# EAGLE design PassivSensor-100 (EAGLE 4.15)
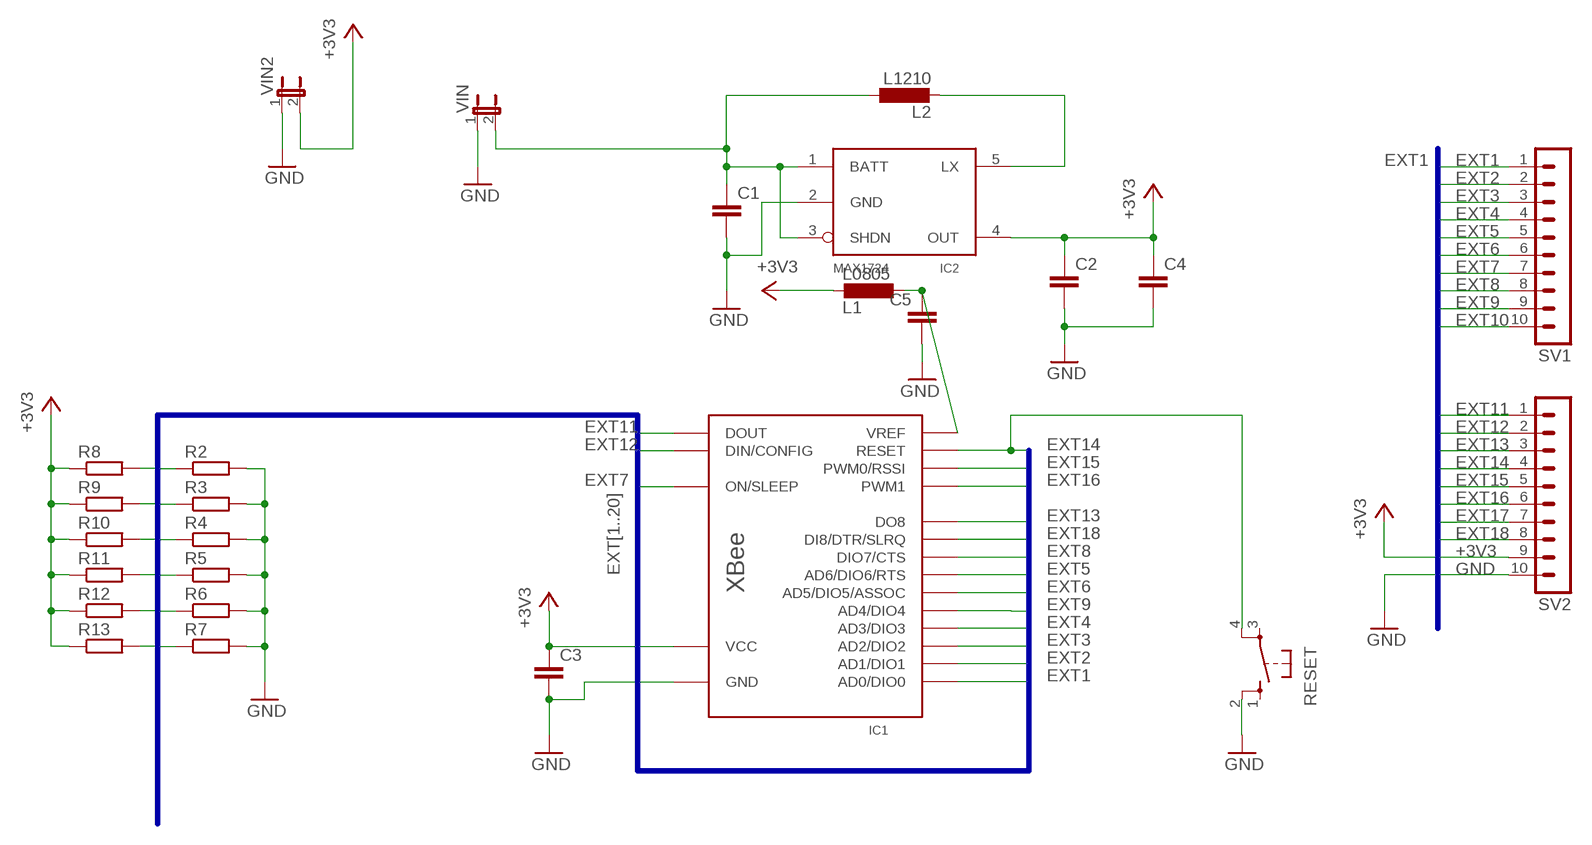
[diagram p0: schematic, sheet 1]

## Parts
C1  C-EUC0805  [C0805]
C2  C-EUC0805  [C0805]
C3  C-EUC0805  [C0805]
C4  C-EUC0805  [C0805]
C5  C-EUC0805  [C0805]
IC1  XBEE  [XBEE]
IC2  MAX1724  [SOT23-5L]
L1  L0805  [C0805]
L2  L1210  [C1210]
R2  R-EU_M0805  [M0805]
R3  R-EU_M0805  [M0805]
R4  R-EU_M0805  [M0805]
R5  R-EU_M0805  [M0805]
R6  R-EU_M0805  [M0805]
R7  R-EU_M0805  [M0805]
R8  R-EU_M0805  [M0805]
R9  R-EU_M0805  [M0805]
R10  R-EU_M0805  [M0805]
R11  R-EU_M0805  [M0805]
R12  R-EU_M0805  [M0805]
R13  R-EU_M0805  [M0805]
RESET  10XX  [B3F-10XX]
SV1  MA10-1  [MA10-1]
SV2  MA10-1  [MA10-1]
VIN  JP1E  [JP1]
VIN2  JP1E  [JP1]

## Nets
+3V3: C2.1 C3.1 C4.1 IC1.1(VCC) IC2.4(OUT) L1.2 R8.1 R9.1 R10.1 R11.1 R12.1 R13.1 SV2.9 VIN2.2
APOWER: C5.1 IC1.14(VREF) L1.1
EXT1: IC1.20(AD0/DIO0) R2.1 R8.2 SV1.1
EXT2: IC1.19(AD1/DIO1) R3.1 R9.2 SV1.2
EXT3: IC1.18(AD2/DIO2) R4.1 R10.2 SV1.3
EXT4: IC1.17(AD3/DIO3) R5.1 R11.2 SV1.4
EXT5: IC1.16(AD6/DIO6/RTS) R6.1 R12.2 SV1.5
EXT6: IC1.15(AD5/DIO5/ASSOC) R7.1 R13.2 SV1.6
EXT7: IC1.13(ON/SLEEP) SV1.7
EXT8: IC1.12(DIO7/CTS) SV1.8
EXT9: IC1.11(AD4/DIO4) SV1.9
EXT10: SV1.10
EXT11: IC1.2(DOUT) SV2.1
EXT12: IC1.3(DIN/CONFIG) SV2.2
EXT13: IC1.4(DO8) SV2.3
EXT14: IC1.5(RESET) RESET.4 SV2.4
EXT15: IC1.6(PWM0/RSSI) SV2.5
EXT16: IC1.7(PWM1) SV2.6
EXT17: SV2.7
EXT18: IC1.9(DI8/DTR/SLRQ) SV2.8
GND: C1.2 C2.2 C3.2 C4.2 C5.2 IC1.10(GND) IC2.2(GND) R2.2 R3.2 R4.2 R5.2 R6.2 R7.2 RESET.2 SV2.10 VIN2.1 VIN.1
N$1: C1.1 IC2.1(BATT) IC2.3(SHDN) L2.1 VIN.2
N$2: IC2.5(LX) L2.2
Unconnected: RESET.1 RESET.3

## Buses
EXT[1..20]

## Library data of the parts
C1-C5 = turbod3:C-EU: CAPACITOR, European symbol
IC1 = turbod3:XBEE
IC2 = turbod3:MAX1724
L1 L2 = turbod3:L
R2-R13 = turbod3:R-EU_: RESISTOR, European symbol
RESET = KEY_B:10XX
SV1 SV2 = con-lstb:MA10-1: PIN HEADER
VIN VIN2 = jumper:JP1E: JUMPER

## Net classes
0 default: width 0.406 mm

## Board
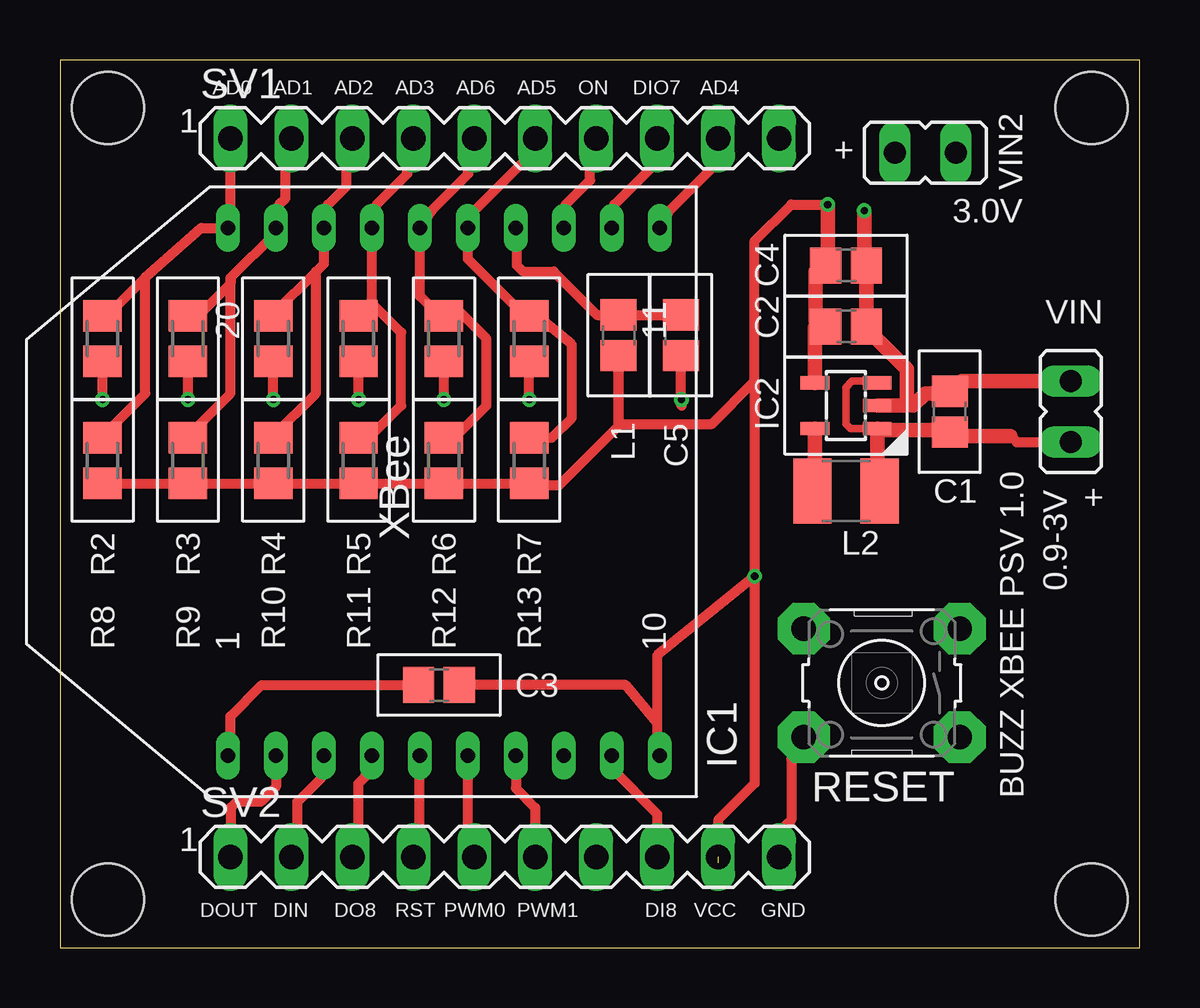
[diagram p1: board, top side]
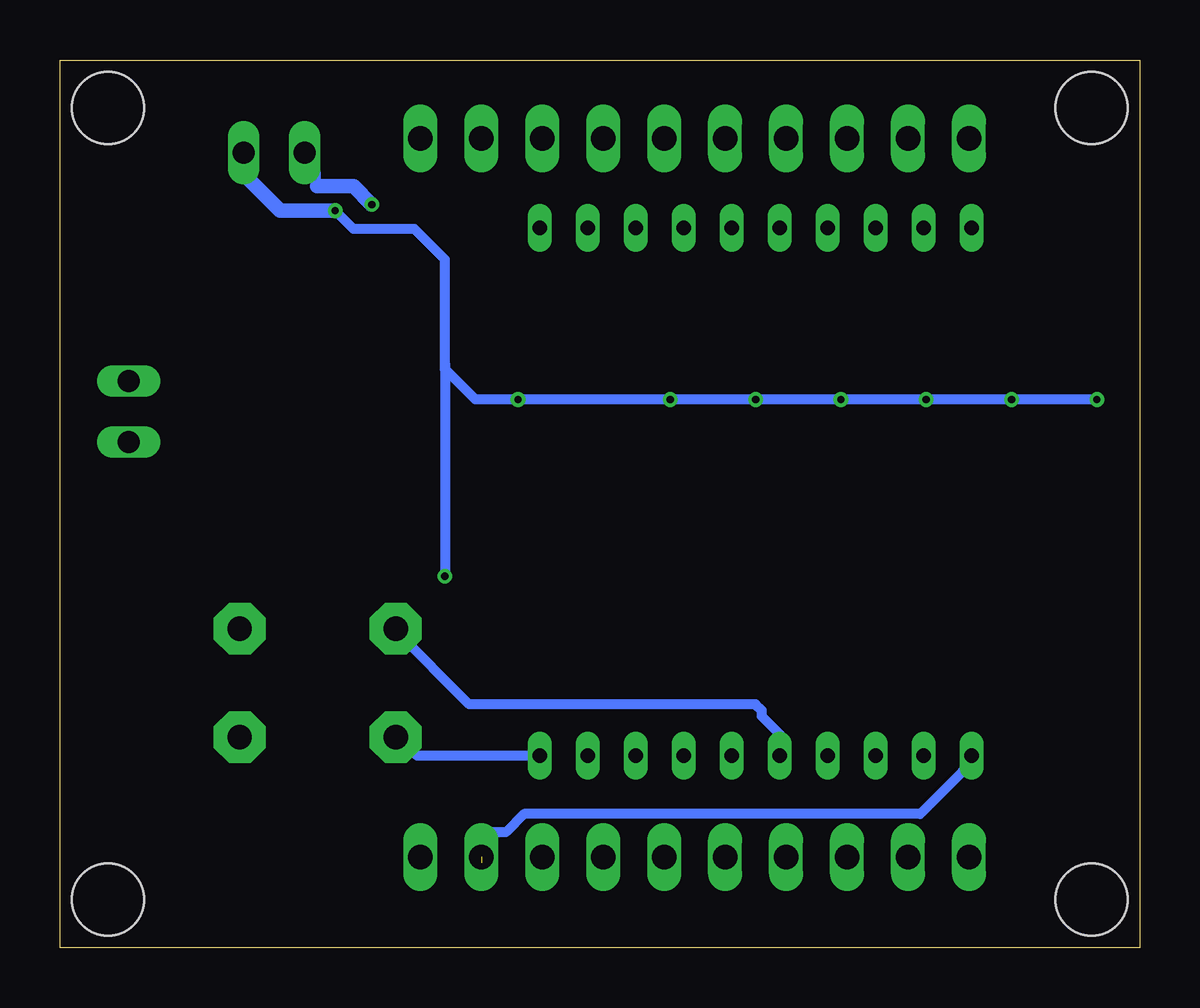
[diagram p2: board, bottom side, seen from below]

Size 45 x 37 mm. Coordinates in mm from the lower left corner, seen from the top.
Outline: 0,0 45,0 45,37 0,37 0,0
Copper layers (1*16): Top 0.035mm / dielectric 1.5mm / Bottom 0.035mm
Design rules "PCB-POOL": minimum track width 6mil, minimum drill 12mil, track to track 6mil, track to pad 6mil, pad to pad 6mil, via to via 6mil, smd to smd 6mil, copper to edge 20mil, drill to drill 8mil, minimum pad ring 8mil, minimum via ring 6mil, stop-mask expansion 3mil, vias tented up to drill 0mil, thermal gap 8mil
Holes 3 mm at 2,35 2,2 43,35 43,2

### Footprints (pad centres in the part's own frame; a part is rotated, then mirrored left to right if it is on the bottom)
C0805 = smd 1.3 x 1.5: 1 -0.85,0; 2 0.85,0
XBEE = drill 0.6 long: 1 -11,17; 2 -11,15; 3 -11,13; 4 -11,11; 5 -11,9; 6 -11,7; 7 -11,5; 8 -11,3; 9 -11,1; 10 -11,-1; 11 11,-1; 12 11,1; 13 11,3; 14 11,5; 15 11,7; 16 11,9; 17 11,11; 18 11,13; 19 11,15; 20 11,17
SOT23-5L = smd 0.55 x 1.2: 1 -0.95,-1.3; 2 0,-1.3; 3 0.95,-1.3; 4 0.95,1.3; 5 -0.95,1.3
C1210 = smd 1.6 x 2.7: 1 -1.4,0; 2 1.4,0
M0805 = smd 1.3 x 1.6: 1 -0.95,0; 2 0.95,0
B3F-10XX = drill 1.016 pad 2.159 octagon: 1 -3.379,2.312; 2 3.123,2.312; 3 -3.379,-2.209; 4 3.123,-2.209
MA10-1 = drill 1.016 long: 1 -11.43,0; 2 -8.89,0; 3 -6.35,0; 4 -3.81,0; 5 -1.27,0; 6 1.27,0; 7 3.81,0; 8 6.35,0; 9 8.89,0; 10 11.43,0
JP1 = drill 0.914 long: 1 0,-1.27; 2 0,1.27

### Placement (x,y rotation side)
C1  37.08,22.34 90 top
C2  32.77,25.89 0 top
C3  15.8,10.94 0 top
C4  32.77,28.43 0 top
C5  25.89,25.52 270 top
IC1  24,19 90 top
IC2  32.77,22.59 90 top
L1  23.29,25.52 270 top
L2  32.77,19.03 180 top
R2  1.78,25.38 270 top
R3  5.33,25.38 270 top
R4  8.89,25.38 270 top
R5  12.45,25.38 270 top
R6  16,25.38 270 top
R7  19.56,25.38 270 top
R8  1.78,20.3 90 top
R9  5.33,20.3 90 top
R10  8.89,20.3 90 top
R11  12.45,20.3 90 top
R12  16,20.3 90 top
R13  19.56,20.3 90 top
RESET  34.13,11.08 180 top
SV1  18.54,33.73 0 top
SV2  18.54,3.78 0 top
VIN  42.13,22.34 180 top
VIN2  36.08,33.13 90 top

### Tracks (layer width: path | path; a pad name or v marks a point on that pad's centre or on a via)
+3V3  (via drill 0.3)  (1 unrouted)
  Top 0.406: R8.1 5.27,19.35 5.33,19.29 R9.1 8.82,19.35 8.89,19.29 R10.1 12.38,19.35 12.45,19.29 R11.1 15.94,19.35 16,19.29 R12.1 19.49,19.35 19.56,19.29 | 19.56,19.29 R13.1 | 19.56,19.29 20.83,19.29 23.29,21.75 L1.2 23.29,21.91 23.37,21.83 27.18,21.83 28.96,23.61 | C3.1 8.42,10.94 7.11,9.64 7.11,8.11 IC1.1 | C2.1 31.92,25.81 31.47,25.35 | C2.1 31.5,25.89 31.47,25.86 | C2.1 31.75,25.89 31.5,26.15 | C4.1 31.75,28.43 31.5,28.18 | 28.96,23.61 28.96,29.45 30.48,30.97 v32,30.97 | 28.96,23.61 28.96,6.84 27.43,5.32 27.43,3.54
  Top 0.61: 31.47,25.86 IC2.4 | 31.5,28.18 31.5,26.15 | C4.1 31.92,28.6 32,28.69 v32,30.97
  Bottom 0.305: VIN2.2 34.87,33.13 35,33 34.29,32.29 34.29,31.73
  Bottom 0.406: SV2.9 26.92,4.81 26.42,4.81 25.65,5.57 9.14,5.57 7.37,7.35 IC1.1
  Bottom 0.61: 34.29,31.73 32.77,31.73 v32,30.97
APOWER
  Top 0.406: C5.1 23.39,26.37 23.37,26.4 23.34,26.37 L1.1 22.38,26.37 20.57,28.18 19.3,28.18 19.05,28.43 19.05,29.96 IC1.14
EXT1
  Top 0.406: SV1.1 7.11,30.97 IC1.20 5.89,30 3.56,27.92 | R2.1 1.78,26.15 3.56,27.92 | R8.2 1.78,21.32 3.56,23.1 3.56,27.92
EXT2
  Top 0.406: SV1.2 9.4,32.5 9.4,31.23 9.14,30.97 IC1.19 9,29.81 7.11,27.92 | R3.1 5.4,26.33 5.59,26.15 7.11,27.67 7.11,27.92 | R9.2 5.33,21.32 7.11,23.1 7.11,27.92
EXT3
  Top 0.406: SV1.3 11.94,32.5 11.94,31.73 11.18,30.97 IC1.18 11,28.51 10.67,28.18 | R4.1 8.89,26.4 10.67,28.18 | R10.2 8.89,21.32 10.67,23.1 10.67,28.18
EXT4
  Top 0.406: SV1.4 14.48,32.5 14.48,32.24 13.21,30.97 IC1.17 13,26.91 | R5.1 12.45,26.15 13,26.7 13,26.91 | R11.2 12.89,21.25 14.22,22.59 14.22,25.64 12.95,26.91 13,26.91
EXT5
  Top 0.406: SV1.5 17.02,32.5 17.02,32.24 15.49,30.72 IC1.16 15,27.15 16,26.15 R6.1 16,26.4 16.26,26.65 16.51,26.65 17.78,25.38 17.78,22.59 16.44,21.25 R12.2
EXT6
  Top 0.406: SV1.6 19.3,32.75 17.27,30.72 IC1.15 17,28.7 19.56,26.15 R7.1 19.75,26.33 19.81,26.4 21.34,25.13 21.34,22.08 20.51,21.25 R13.2
EXT7
  Top 0.406: IC1.13 21.08,30.97 22.1,31.99 22.1,32.5 SV1.7
EXT8
  Top 0.406: IC1.12 23.11,30.97 24.64,32.5 SV1.8
EXT9
  Top 0.406: IC1.11 25.4,30.72 27.18,32.5 SV1.9
EXT11
  Top 0.406: IC1.2 9,6.7 8.38,6.08 7.37,6.08 7.11,5.83 7.11,4.05 6.86,3.79 6.87,3.78 SV2.1
EXT12
  Top 0.406: IC1.3 10.92,7.1 9.91,6.08 9.91,5.06 SV2.2
EXT13
  Top 0.406: IC1.4 12.7,7.1 12.45,6.84 12.45,5.06 SV2.3
EXT14
  Top 0.406: IC1.5 14.99,7.1 14.99,5.06 SV2.4
  Bottom 0.406: IC1.5 15,8.89 15.75,9.64 15.75,9.89 16,10.14 27.94,10.14 31.01,13.21 RESET.4
EXT15
  Top 0.406: IC1.6 17.02,7.1 17.02,5.06 SV2.5
EXT16
  Top 0.406: IC1.7 19,6.64 19.81,5.83 19.81,3.79 19.83,3.78 | 20.07,3.54 19.83,3.78 | 19.83,3.78 SV2.6
EXT18
  Top 0.406: IC1.9 23,7.46 24.89,5.57 SV2.8
GND  (via drill 0.3)
  Top 0.406: SV2.10 30.23,5.06 30.48,5.32 30.48,7.86 RESET.2 | v1.78,22.84 R2.2 | 5.33,24.62 R3.2 v5.33,22.84 | v8.89,22.84 R4.2 | v12.45,22.84 R5.2 | v16,22.84 R6.2 | v19.56,22.84 R7.2 | C3.2 23.59,10.94 24.89,9.38 | IC2.2 34.04,22.59 | 25.89,22.61 C5.2 25.89,22.86 v25.91,22.84 25.89,22.83 25.89,22.61 | 25.89,22.61 25.91,22.59 | 33.62,25.54 C2.2 33.58,25.84 33.53,25.89 | C1.2 37.08,23.1 37.59,23.61 | 35.31,22.59 35.56,22.59 | 33.53,28.43 33.62,28.34 | 24.89,9.38 24.89,12.18 v28.96,15.48 | 24.89,9.38 24.89,8.11 IC1.10 | IC1.10 25.15,7.86 | IC1.10
  Top 0.61: 37.59,23.61 VIN.1 | 37.08,23.1 36.07,23.1 35.56,22.59 | IC2.2 35.31,22.59 35.31,24.11 33.58,25.84 | 33.62,28.34 C2.2 | C4.2 33.53,28.43 v33.53,30.72
  Bottom 0.406: v1.78,22.84 v5.33,22.84 v8.89,22.84 v12.45,22.84 v16,22.84 v19.56,22.84 v25.91,22.84 27.69,22.84 28.96,24.11 28.96,24.37 | 28.96,24.37 28.96,28.69 30.23,29.96 32.77,29.96 v33.53,30.72 | 28.96,24.37 v28.96,15.48 | RESET.2 31.01,8.86 30.99,8.87 30.11,8 IC1.10
  Bottom 0.61: VIN2.1 37.35,32.25 35.81,30.72 v33.53,30.72
N$1
  Top 0.305: IC2.1 32.95,21.64 32.77,21.83 32.77,23.35 33.02,23.61 34.29,23.61
  Top 0.406: 34.12,21.49 34.04,21.57 34.07,21.6 IC2.1 | L2.1 34.17,18.65 34.04,18.78 34.07,18.81 | 34.29,23.61 34.22,23.54 IC2.3 | VIN.2 39.88,21.07 39.62,21.32 | C1.1 37.08,21.32 36.92,21.49 36.66,21.49 36.58,21.57
  Top 0.61: 34.07,18.81 IC2.1 | 37.08,21.32 39.62,21.32 | 34.04,21.57 36.58,21.57
N$2
  Top 0.406: L2.2 31.37,18.65 31.5,18.78 31.47,18.81
  Top 0.61: 31.47,18.81 IC2.5

### Text on the board
tNames: AD0 | AD1 | AD2 | AD3 | AD6 | AD5 | ON | DIO7 | AD4 | + | 3.0V | 0.9-3V | + | BUZZ XBEE PSV 1.0 | DOUT | DIN | DO8 | RST | PWM0 | PWM1 | DI8 | VCC | GND